# Altium project Heracles Nadir Panel.PrjPcb
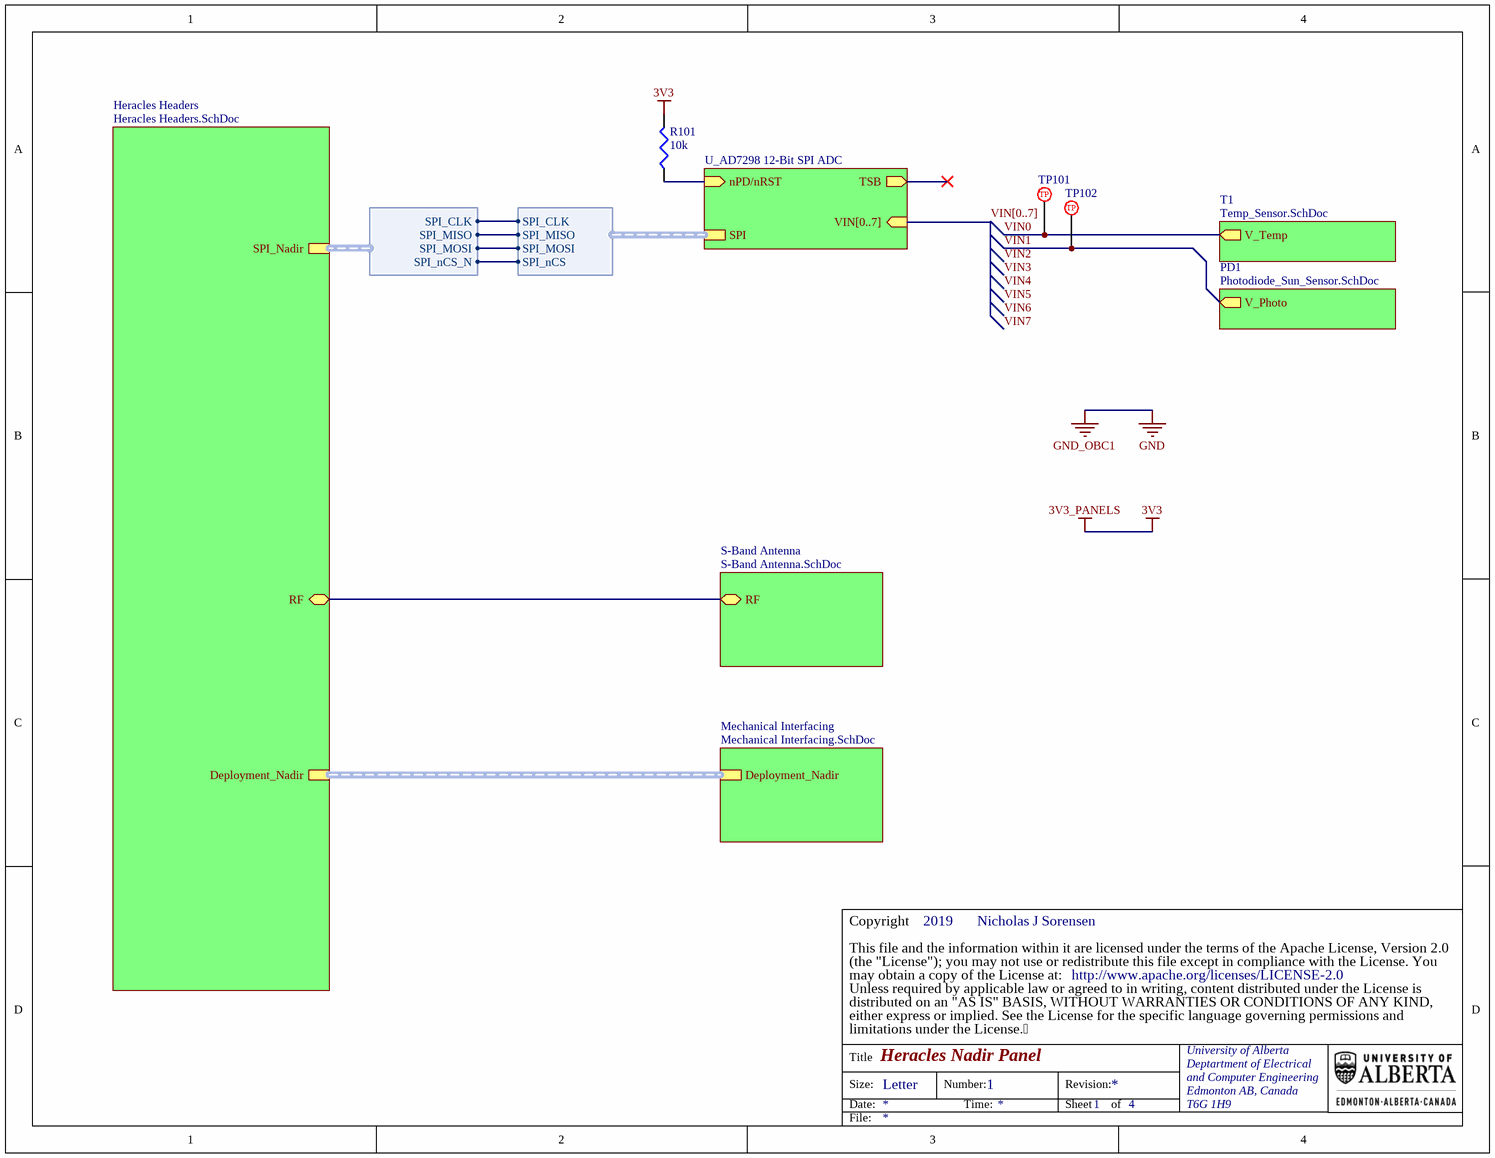
[diagram p0: Heracles Nadir Panel.SchDoc]
7 sheets, 30 parts. Net scope: hierarchical (ports join the sheet entries above them; power ports are global).
Board file: Heracles Nadir Panel.PcbDoc
Sheets:
  Heracles Nadir Panel.SchDoc
    Heracles Headers = Heracles Headers.SchDoc
    S-Band Antenna = S-Band Antenna.SchDoc
    Mechanical Interfacing = Mechanical Interfacing.SchDoc
    U_AD7298 12-Bit SPI ADC = AD7298 12-Bit SPI ADC.SchDoc
    T1 = Temp_Sensor.SchDoc
    PD1 = Photodiode_Sun_Sensor.SchDoc

## Sheet Heracles Nadir Panel.SchDoc: Heracles Nadir Panel
size Letter; Author: Nicholas J Sorensen; CompanyName: AlbertaSat; Engineer: Nicholas J Sorensen; DocumentNumber: 1; SheetNumber: 1; SheetTotal: 4; CopyrightYear: 2019

### Parts
R101  value 10k  [VSH-0603MCT]  (hidden comment: Res3)
TP101  5017  [KS-5017]  (value not drawn)
TP102  5017  [KS-5017]  (value not drawn)

### Sub-sheets
Heracles Headers = Heracles Headers.SchDoc: RF (bidir), SPI_Nadir (harness SPI_Nadir), Deployment_Nadir
Mechanical Interfacing = Mechanical Interfacing.SchDoc: Deployment_Nadir
PD1 = Photodiode_Sun_Sensor.SchDoc: V_Photo (out)
S-Band Antenna = S-Band Antenna.SchDoc: RF (bidir)
T1 = Temp_Sensor.SchDoc: V_Temp (out)
U_AD7298 12-Bit SPI ADC = AD7298 12-Bit SPI ADC.SchDoc: nPD/nRST (in), TSB (out), VIN[0..7] (in), SPI (harness AD7298_SPI)

### Harnesses
AD7298_SPI: SPI_CLK, SPI_MISO, SPI_MOSI, SPI_nCS
SPI_Nadir: SPI_CLK, SPI_MISO, SPI_MOSI, SPI_nCS_N

### Nets
3V3: R101.2  [also labelled 3V3_PANELS]
ADC_SPI_nCS_N: sheet U_AD7298 12-Bit SPI ADC/SPI.SPI_nCS, sheet Heracles Headers/SPI_Nadir.SPI_nCS_N
SPI_CLK: sheet U_AD7298 12-Bit SPI ADC/SPI.SPI_CLK, sheet Heracles Headers/SPI_Nadir.SPI_CLK
SPI_MISO: sheet U_AD7298 12-Bit SPI ADC/SPI.SPI_MISO, sheet Heracles Headers/SPI_Nadir.SPI_MISO
SPI_MOSI: sheet U_AD7298 12-Bit SPI ADC/SPI.SPI_MOSI, sheet Heracles Headers/SPI_Nadir.SPI_MOSI
VIN0: TP101.1 ; sheet T1/V_Temp
VIN1: TP102.1 ; sheet PD1/V_Photo  [project net V_Photo]
NetA301_1: sheet Heracles Headers/RF, sheet S-Band Antenna/RF
NetR101_1: R101.1 ; sheet U_AD7298 12-Bit SPI ADC/nPD/nRST

### Buses and harness runs
bus VIN[0..7] = sheet U_AD7298 12-Bit SPI ADC/VIN[0..7]
harness sheet Heracles Headers/Deployment_Nadir = sheet Mechanical Interfacing/Deployment_Nadir

### Notes on the sheet
- Labels drawn without touching a wire or pin: VIN2, VIN3, VIN4, VIN5, VIN6, VIN7
- (the "License"); you may not use or redistribute this file except in compliance with the License. You
- This file and the information within it are licensed under the terms of the Apache License, Version 2.0
- Copyright
- Unless required by applicable law or agreed to in writing, content distributed under the License is
- distributed on an "AS IS" BASIS, WITHOUT WARRANTIES OR CONDITIONS OF ANY KIND,
- either express or implied. See the License for the specific language governing permissions and
- limitations under the License.
- may obtain a copy of the License at:
- http://www.apache.org/licenses/LICENSE-2.0
- Title
- Size:
- Date:
- Letter
- Number:
- Time:
- Revision:
- Sheet
- of
- University of Alberta
- Deptartment of Electrical
- and Computer Engineering
- Edmonton AB, Canada
- T6G 1H9
- File:
- (in symbol PTP-KS-00001) TP

### Library data of the parts
R101 = PR-VSH-00143: RES SMD 10K OHM 1% 1/8W 0603; Manufacturer Part Number: MCT06030C1002FP500; Index: 143; Designator: R?; Temperature Coefficient: ±50ppm/°C; Published: 3/14/2016; LatestRevisionDate: 3/14/2016; LatestRevisionNote: ...; PackageReference: 0603 (1608 Metric); Publisher: AlbertaSat; PackageDescription: Chip Resistor, 2-Leads, Body 1.55x0.85mm, IPC Low Density; Part Number: PR-VSH-00143; Supplier Part Number 1: MCT0603-10.0K-CFCT-ND; Supplier 1: Digi-key; Supplier Link: http://www.digikey.ca/product-search/en?keywords=MCT0603-10.0K-CFCT-ND; Tolerance: ±1%; Power - Rated: 1/8W; Applications: General Purpose
TP101 TP102 = PTP-KS-00001: PC TEST POINT MINI SMD; Index: 1; Supplier 1: Digi-key; Supplier 2: Newark; Supplier 3: Mouser; Part Number: PTP-KS-00001; Manufacturer Part Number: 5017; Supplier Part Number 1: 36-5017CT-ND; Publisher: AlbertaSat; Published: 3/15/2016; LatestRevisionDate: 3/15/2016; LatestRevisionNote: ...; PackageReference: KS-5017; PackageDescription: Testpoint Lug Mini SMD 27X10X152; Supplier Link: http://www.digikey.ca/product-detail/en/keystone-electronics/5017/36-5017TR-ND/2217304

## Sheet Heracles Headers.SchDoc: Heracles Headers
size Letter; Author: Nicholas J. Sorensen; Engineer: Nicholas J. Sorensen; DocumentNumber: 2; SheetNumber: 2; SheetTotal: 4
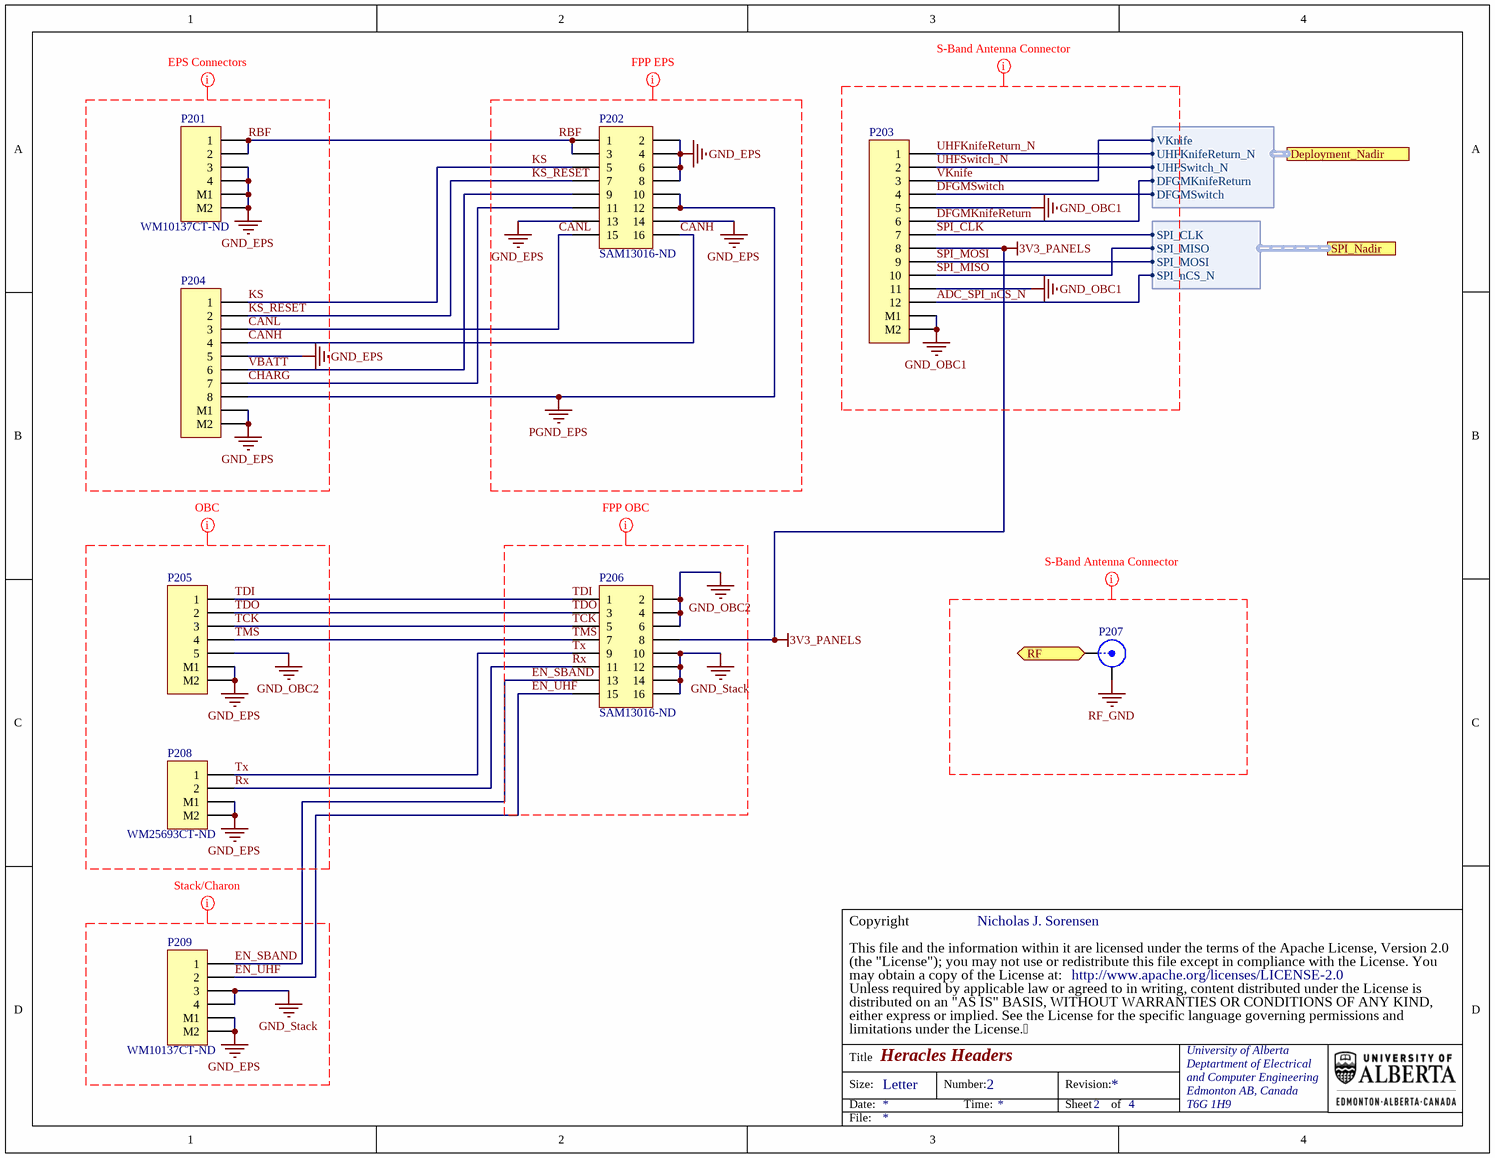
[diagram p1: Heracles Headers.SchDoc]

### Parts
P201  WM10137CT-ND  [MOLX-5040500491]
P202  SAM13016-ND  [TSS-108-01-G-D]
P203  PICOLOCK 12  [MOLX-5040501291]  (value not drawn)
P204  WM14421CT-ND  [MOLX-5040500891]  (value not drawn)
P205  PICOLOCK 5  [MOLX-5040500591]  (value not drawn)
P206  SAM13016-ND  [TSS-108-01-G-D]
P207  J10399-ND  [J10399-ND]  (value not drawn)
P208  WM25693CT-ND  [MOLX-5040500291]
P209  WM10137CT-ND  [MOLX-5040500491]

### Ports
Deployment_Nadir (harness Deployment_Nadir), RF (bidir), SPI_Nadir (harness SPI_Nadir)

### Harnesses
Deployment_Nadir: UHFSwitch_N, UHFKnifeReturn_N, VKnife, DFGMKnifeReturn, DFGMSwitch
SPI_Nadir: SPI_CLK, SPI_MISO, SPI_MOSI, SPI_nCS_N

### Nets
3V3_PANELS: P203.8 P206.8  [project net 3V3]
GND_EPS: P201.3 P201.4 P201.M1 P201.M2 P202.2 P202.4 P202.6 P202.8 P202.13 P202.14 P204.5 P204.M1 P204.M2 P205.M1 P205.M2 P208.M1 P208.M2 P209.M1 P209.M2
GND_OBC1: P203.5 P203.11 P203.M1 P203.M2  [project net GND]
GND_OBC2: P205.5 P206.2 P206.4 P206.6
GND_Stack: P206.10 P206.12 P206.14 P206.16 P209.3 P209.4
PGND_EPS: P202.10 P202.12 P204.8
RF_GND: P207.2(Y)
ADC_SPI_nCS_N: P203.12 ; port SPI_Nadir.SPI_nCS_N
CANH: P202.16 P204.4
CANL: P202.15 P204.3
CHARG: P202.11 P204.7
DFGMKnifeReturn: P203.6 ; port Deployment_Nadir.DFGMKnifeReturn
DFGMSwitch: P203.4 ; port Deployment_Nadir.DFGMSwitch
EN_SBAND: P206.13 P209.1
EN_UHF: P206.15 P209.2
KS: P202.5 P204.1
KS_RESET: P202.7 P204.2
RBF: P201.1 P201.2 P202.1 P202.3
Rx: P206.11 P208.2
SPI_CLK: P203.7 ; port SPI_Nadir.SPI_CLK
SPI_MISO: P203.10 ; port SPI_Nadir.SPI_MISO
SPI_MOSI: P203.9 ; port SPI_Nadir.SPI_MOSI
TCK: P205.3 P206.5
TDI: P205.1 P206.1
TDO: P205.2 P206.3
TMS: P205.4 P206.7
Tx: P206.9 P208.1
UHFKnifeReturn_N: P203.1 ; port Deployment_Nadir.UHFKnifeReturn_N
UHFSwitch_N: P203.2 ; port Deployment_Nadir.UHFSwitch_N
VBATT: P202.9 P204.6
VKnife: P203.3 ; port Deployment_Nadir.VKnife
NetA301_1: P207.1(X) ; port RF

### Layout directives
mark named EPS Connectors: CANH, CANL, CHARG, GND_EPS, KS, KS_RESET, RBF, VBATT
mark named OBC: GND_EPS, GND_OBC2, Rx, TCK, TDI, TDO, TMS, Tx
mark named FPP EPS: CANH, CANL, GND_EPS, KS, KS_RESET, PGND_EPS, RBF
mark named FPP OBC: EN_SBAND, EN_UHF, GND_OBC2, GND_Stack, Rx, TCK, TDI, TDO, TMS, Tx
mark named Stack/Charon: EN_SBAND, EN_UHF, GND_EPS, GND_Stack
mark named S-Band Antenna Connector: 3V3_PANELS, ADC_SPI_nCS_N, DFGMKnifeReturn, DFGMSwitch, GND_OBC1, RF_GND, SPI_CLK, SPI_MISO, SPI_MOSI, UHFKnifeReturn_N, UHFSwitch_N, VKnife

### Notes on the sheet
- (the "License"); you may not use or redistribute this file except in compliance with the License. You
- This file and the information within it are licensed under the terms of the Apache License, Version 2.0
- Copyright
- Unless required by applicable law or agreed to in writing, content distributed under the License is
- distributed on an "AS IS" BASIS, WITHOUT WARRANTIES OR CONDITIONS OF ANY KIND,
- either express or implied. See the License for the specific language governing permissions and
- limitations under the License.
- may obtain a copy of the License at:
- http://www.apache.org/licenses/LICENSE-2.0
- Title
- Size:
- Date:
- Letter
- Number:
- Time:
- Revision:
- Sheet
- of
- University of Alberta
- Deptartment of Electrical
- and Computer Engineering
- Edmonton AB, Canada
- T6G 1H9
- File:

### Library data of the parts
P201 P209 = 63: CONN HEADER SMD R/A 4POS 1.5MM; Part Number: 63; Manufacturer Part Number: 5040500491; Designator: P?; LatestRevisionDate: 17-Jul-2002; LatestRevisionNote: Re-released for DXP Platform.; Publisher: Altium Limited; Supplier Part Number 1: WM10137CT-ND; Supplier 1: Digi-Key; Supplier Link: #https://www.digikey.ca/product-detail/en/molex/5040500491/WM10137CT-ND/4357653#
P202 P206 = PP-SAM-00007: CONN HEADER VERT 16POS 2.54MM; Index: 8; LatestRevisionDate: 7/1/2020; LatestRevisionNote: ...; Publisher: AlbertaSat; Part Number: PP-SAM-00007; Manufacturer Part Number: TSS-108-01-G-D; Supplier Part Number 1: SAM13016-ND; Supplier 1: Digi-key; Published: 7/1/2020; Supplier Link: #https://www.digikey.ca/en/products/detail/samtec-inc/TSS-108-01-G-D/2345166#
P203 = 71: CONN HEADER SMD R/A 12POS 1.5MM; Part Number: 71; Manufacturer Part Number: 5040501291; Designator: P?; LatestRevisionDate: 17-Jul-2002; LatestRevisionNote: Re-released for DXP Platform.; Publisher: Altium Limited; Supplier Part Number 1: WM16219CT-ND; Supplier 1: Digi-Key; Supplier Link: #https://www.digikey.ca/product-detail/en/molex/5040501291/WM16219CT-ND/6702294#
P204 = 67: CONN HEADER SMD R/A 8POS 1.5MM; Part Number: 67; Manufacturer Part Number: 5040500891; Designator: P?; LatestRevisionDate: 17-Jul-2002; LatestRevisionNote: Re-released for DXP Platform.; Publisher: Altium Limited; Supplier Part Number 1: WM14421CT-ND; Supplier 1: Digi-Key; Supplier Link: #https://www.digikey.ca/product-detail/en/molex/5040500891/WM14421CT-ND/6133151#
P205 = 64: CONN HEADER SMD R/A 5POS 1.5MM; Part Number: 64; Manufacturer Part Number: 5040500591; Designator: P?; LatestRevisionDate: 17-Jul-2002; LatestRevisionNote: Re-released for DXP Platform.; Publisher: Altium Limited; Supplier Part Number 1: WM24877CT-ND; Supplier 1: Digi-Key; Supplier Link: https://www.digikey.ca/product-detail/en/molex/5040500591/WM24877CT-ND/9659635
P207 = P01-CIN-00000: CONN SMB PLUG R/A 50OHM PCB; Manufacturer Part Number: Cinch Connectivity Solutions Johnson; Index: 1; Designator: P?; LatestRevisionDate: 7/6/2020; LatestRevisionNote: ...; Publisher: AlbertaSat; Part Number: P01-CIN-00000; Supplier Part Number 1: J10399-ND; Supplier 1: Digi-key; Published: 7/6/2020; Supplier Link: #https://www.digikey.ca/en/products/detail/cinch-connectivity-solutions-johnson/131-1801-371/251419#
P208 = 61: CONN HEADER SMD R/A 2POS 1.5MM; Part Number: 61; Manufacturer Part Number: 5040500291; Designator: P?; LatestRevisionDate: 17-Jul-2002; LatestRevisionNote: Re-released for DXP Platform.; Publisher: Altium Limited; Supplier Part Number 1: WM25693CT-ND; Supplier 1: Digi-Key; Supplier Link: #https://www.digikey.ca/product-detail/en/molex/5040500291/WM25693CT-ND/9954119#

## Sheet S-Band Antenna.SchDoc: S-Band Antenna
size Letter; Author: Nicholas J. Sorensen; Engineer: Nicholas J. Sorensen; DocumentNumber: 3; SheetNumber: 3; SheetTotal: 4
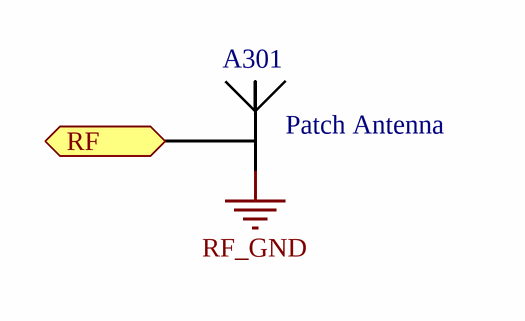
[diagram p2: S-Band Antenna.SchDoc]

### Parts
A301  Patch Antenna  [Patch_Antenna]

### Ports
RF (bidir)

### Nets
RF_GND: A301.2
NetA301_1: A301.1 ; port RF

### Notes on the sheet
- (the "License"); you may not use or redistribute this file except in compliance with the License. You
- This file and the information within it are licensed under the terms of the Apache License, Version 2.0
- Copyright
- Unless required by applicable law or agreed to in writing, content distributed under the License is
- distributed on an "AS IS" BASIS, WITHOUT WARRANTIES OR CONDITIONS OF ANY KIND,
- either express or implied. See the License for the specific language governing permissions and
- limitations under the License.
- may obtain a copy of the License at:
- http://www.apache.org/licenses/LICENSE-2.0
- Title
- Size:
- Date:
- Letter
- Number:
- Time:
- Revision:
- Sheet
- of
- University of Alberta
- Deptartment of Electrical
- and Computer Engineering
- Edmonton AB, Canada
- T6G 1H9
- File:

### Library data of the parts
A301 = PXX-ABS-00009: Manufacturer Part Number: Custom; Index: 9; Part Number: PXX-ABS-00009; Supplier 1: Digi-key; Publisher: AlbertaSat; LatestRevisionNote: ...

## Sheet Mechanical Interfacing.SchDoc: Mechanical Interfacing
size Letter; Author: Nicholas J. Sorensen; Engineer: Nicholas J. Sorensen; DocumentNumber: 4; SheetNumber: 4; SheetTotal: 4
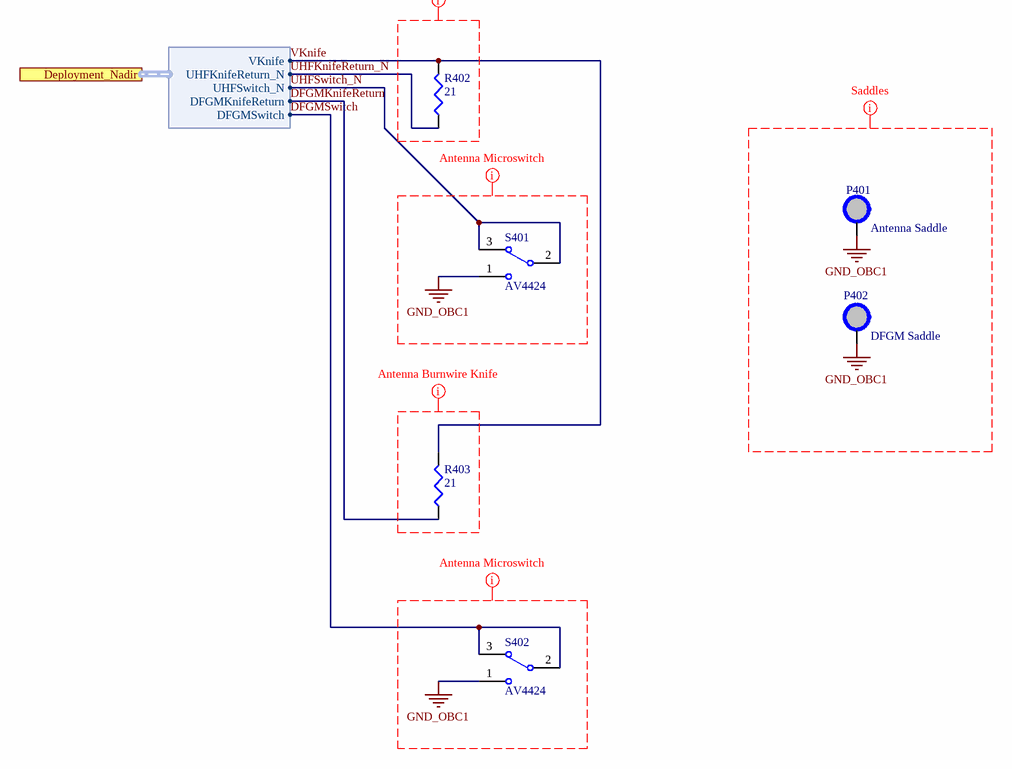
[diagram p3: Mechanical Interfacing.SchDoc]

### Parts
P401  Antenna Saddle  [ANTENNA_SADDLE]
P402  DFGM Saddle  [DFGM_Saddle]
R402  value 21  [VSH-CPF1]  (hidden comment: Res3)
R403  value 21  [VSH-CPF1]  (hidden comment: Res3)
S401  AV4424  [PANA-AV4424]
S402  AV4424  [PANA-AV4424]

### Ports
Deployment_Nadir (harness Deployment_Nadir)

### Harnesses
Deployment_Nadir: UHFSwitch_N, UHFKnifeReturn_N, VKnife, DFGMKnifeReturn, DFGMSwitch

### Nets
GND_OBC1: P401.1 P402.1 S401.1(NO) S402.1(NO)  [project net GND]
DFGMKnifeReturn: R403.1 ; port Deployment_Nadir.DFGMKnifeReturn
DFGMSwitch: S402.2(COM) S402.3(NC) ; port Deployment_Nadir.DFGMSwitch
UHFKnifeReturn_N: R402.1 ; port Deployment_Nadir.UHFKnifeReturn_N
UHFSwitch_N: S401.2(COM) S401.3(NC) ; port Deployment_Nadir.UHFSwitch_N
VKnife: R402.2 R403.2 ; port Deployment_Nadir.VKnife

### Layout directives
mark named Antenna Burnwire Knife: (no net found under the mark)
mark named Antenna Microswitch: GND_OBC1
mark named Saddles: GND_OBC1

### Notes on the sheet
- (the "License"); you may not use or redistribute this file except in compliance with the License. You
- This file and the information within it are licensed under the terms of the Apache License, Version 2.0
- Copyright
- Unless required by applicable law or agreed to in writing, content distributed under the License is
- distributed on an "AS IS" BASIS, WITHOUT WARRANTIES OR CONDITIONS OF ANY KIND,
- either express or implied. See the License for the specific language governing permissions and
- limitations under the License.
- may obtain a copy of the License at:
- http://www.apache.org/licenses/LICENSE-2.0
- Title
- Size:
- Date:
- Letter
- Number:
- Time:
- Revision:
- Sheet
- of
- University of Alberta
- Deptartment of Electrical
- and Computer Engineering
- Edmonton AB, Canada
- T6G 1H9
- File:

### Library data of the parts
P401 = PXX-ABS-00001: Manufacturer Part Number: Custom; Index: 1; Designator: M?; Part Number: PXX-ABS-00001; Supplier 1: Digi-key; Publisher: AlbertaSat; LatestRevisionNote: ...
P402 = PXX-ABS-00010: Manufacturer Part Number: Custom; Index: 10; Designator: P?; Part Number: PXX-ABS-00010; Supplier 1: Digi-key; Publisher: AlbertaSat; LatestRevisionNote: ...
R402 R403 = PR-VSH-00317: 21 Ohms ±1% 1W Through Hole Resistor Axial Flame Proof, Moisture Resistant, Safety Metal Film; Manufacturer Part Number: CPF121R000FKEE6; Index: 317; Designator: R?; Temperature Coefficient: ±100ppm/°C; Published: 2/27/2020; LatestRevisionDate: 2/27/2020; LatestRevisionNote: ...; PackageReference: VSH-CPF1; Publisher: AlbertaSat; PackageDescription: Chip Resistor; Part Number: PR-VSH-00317; Supplier Part Number 1: CPF21.0CCT-ND; Supplier 1: Digi-key; Supplier Link: #https://www.digikey.ca/product-detail/en/vishay-dale/CPF121R000FKEE6/CPF21.0CCT-ND/2713126#; Tolerance: ±1%; Power - Rated: 1W
S401 S402 = 20035: SWITCH SNAP ACT SPDT 500MA 30V; Part Number: 20035; Manufacturer Part Number: AV4424; Supplier Part Number 1: 255-3743-ND; Supplier 1: Digi-Key; Supplier Link: #https://www.digikey.com/product-detail/en/panasonic-electric-works/AV4424/255-3743-ND/646766#

## Sheet AD7298 12-Bit SPI ADC.SchDoc: AD7298 12-Bit SPI ADC
size Letter; Author: Nicholas J. Sorensen, and Erik F. Halliwell; Engineer: Nicholas J. Sorensen, and Erik F. Halliwell*; DocumentNumber: 2; SheetNumber: 2; SheetTotal: 7; CopyrightYear: 2019
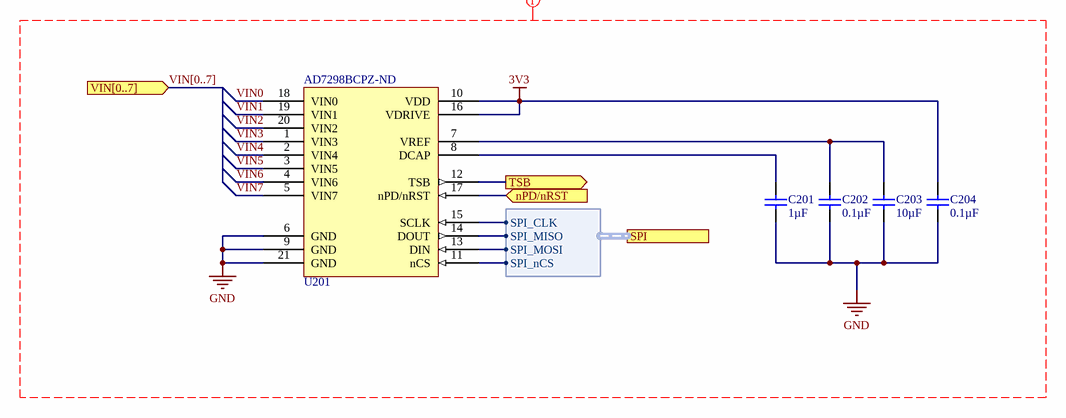
[diagram p4: AD7298 12-Bit SPI ADC.SchDoc]

### Parts
C201  value 1µF  [TDK-CGA3E]
C202  value 0.1µF  [TDK-CGA2B]
C203  value 10µF  [TDK-CGA5L]
C204  value 0.1µF  [TDK-CGA2B]
U201  AD7298BCPZ-ND  [ADI-CP-20-8]

### Ports
nPD/nRST (in), SPI (harness AD7298_SPI), TSB (out), VIN[0..7] (in)

### Harnesses
AD7298_SPI: SPI_MOSI, SPI_MISO, SPI_CLK, SPI_nCS

### Nets
3V3: C204.1 U201.10(VDD) U201.16(VDRIVE)
GND: C201.1 C202.2 C203.2 C204.2 U201.6(GND) U201.9(GND) U201.21(GND)
ADC_SPI_nCS_N: U201.11(nCS) ; port SPI.SPI_nCS
SPI_CLK: U201.15(SCLK) ; port SPI.SPI_CLK
SPI_MISO: U201.14(DOUT) ; port SPI.SPI_MISO
SPI_MOSI: U201.13(DIN) ; port SPI.SPI_MOSI
VIN0: U201.18(VIN0)
VIN1: U201.19(VIN1)  [project net V_Photo]
VIN2: U201.20(VIN2)
VIN3: U201.1(VIN3)
VIN4: U201.2(VIN4)
VIN5: U201.3(VIN5)
VIN6: U201.4(VIN6)
VIN7: U201.5(VIN7)
NetC201_2: C201.2 U201.8(DCAP)
NetC202_1: C202.1 C203.1 U201.7(VREF)
NetR101_1: U201.17(nPD/nRST) ; port nPD/nRST
NetU201_12: U201.12(TSB) ; port TSB

### Buses and harness runs
bus VIN[0..7] = port VIN[0..7]

### Layout directives
mark named ADC: 3V3, GND, VIN0, VIN1, VIN2, VIN3, VIN4, VIN5, VIN6, VIN7, VIN[0..7]

### Notes on the sheet
- (the "License"); you may not use or redistribute this file except in compliance with the License. You
- This file and the information within it are licensed under the terms of the Apache License, Version 2.0
- Copyright
- Unless required by applicable law or agreed to in writing, content distributed under the License is
- distributed on an "AS IS" BASIS, WITHOUT WARRANTIES OR CONDITIONS OF ANY KIND,
- either express or implied. See the License for the specific language governing permissions and
- limitations under the License.
- may obtain a copy of the License at:
- http://www.apache.org/licenses/LICENSE-2.0
- Title
- Size:
- Date:
- Letter
- Number:
- Time:
- Revision:
- Sheet
- of
- University of Alberta
- Deptartment of Electrical
- and Computer Engineering
- Edmonton AB, Canada
- T6G 1H9
- File:

### Library data of the parts
C201 = PC-TDK-02603: CAP CER 1UF 25V X7R 0603; Manufacturer Part Number: CGA3E1X7R1E105K080AC; Index: 2603; Tolerance: ±10%; Designator: C?; Published: 3/16/2016; LatestRevisionDate: 3/16/2016; LatestRevisionNote: ...; PackageReference: 0603 (1608 Metric); Publisher: AlbertaSat; Part Number: PC-TDK-02603; Supplier Part Number 1: 445-6931-1-ND; Supplier 1: Digi-key; Supplier Link: http://www.digikey.ca/product-search/en?keywords=445-6931-1-ND; Voltage - Rated: 25V; Temperature Coefficient: X7R; Applications: Automotive
C202 C204 = PC-TDK-02259: CAP CER 0.1UF 50V X7R 0402; Manufacturer Part Number: CGA2B3X7R1H104K050BB; Index: 2259; Tolerance: ±10%; Designator: C?; Published: 3/16/2016; LatestRevisionDate: 3/16/2016; LatestRevisionNote: ...; PackageReference: 0402 (1005 Metric); Publisher: AlbertaSat; Part Number: PC-TDK-02259; Supplier Part Number 1: 445-6899-1-ND; Supplier 1: Digi-key; Supplier Link: http://www.digikey.ca/product-search/en?keywords=445-6899-1-ND; Voltage - Rated: 50V; Temperature Coefficient: X7R; Applications: Automotive
C203 = PC-TDK-02917: CAP CER 10UF 25V X7R 1206; Manufacturer Part Number: CGA5L1X7R1E106K160AC; Index: 2917; Tolerance: ±10%; Designator: C?; Published: 3/16/2016; LatestRevisionDate: 3/16/2016; LatestRevisionNote: ...; PackageReference: 1206 (3216 Metric); Publisher: AlbertaSat; Part Number: PC-TDK-02917; Supplier Part Number 1: 445-6990-1-ND; Supplier 1: Digi-key; Supplier Link: http://www.digikey.ca/product-search/en?keywords=445-6990-1-ND; Voltage - Rated: 25V; Temperature Coefficient: X7R; Applications: Automotive
U201 = PU-ADI-00007: IC ADC 12BIT SAR 20LFCSP-WQ; Index: 7; Designator: U?; Part Number: PU-ADI-00007; Manufacturer Part Number: AD7298BCPZ; Supplier Part Number 1: AD7298BCPZ-ND; Supplier 1: Digi-key; Supplier Part Number 2: 584-AD7298BCPZ; Supplier 2: Mouser; Publisher: AlbertaSat; Published: 7/16/2019; LatestRevisionDate: 7/16/2019; LatestRevisionNote: ...; PackageReference: 20-WFQFN Exposed Pad; PackageDescription: QFN, 20-Leads, Body 4.00x4.00mm, Pitch 0.50mm, Thermal Pad 2.55x2.55mm, IPC Low Density; Supplier Link: #https://www.digikey.ca/product-detail/en/analog-devices-inc/AD7298BCPZ/AD7298BCPZ-ND/2507320#

## Sheet Temp_Sensor.SchDoc: Temp_Sensor
size Letter; Author: Nicholas J. Sorensen, and Erik F. Halliwell; Engineer: Nicholas J. Sorensen, and Erik F. Halliwell; DocumentNumber: 5; SheetNumber: 5; SheetTotal: 7
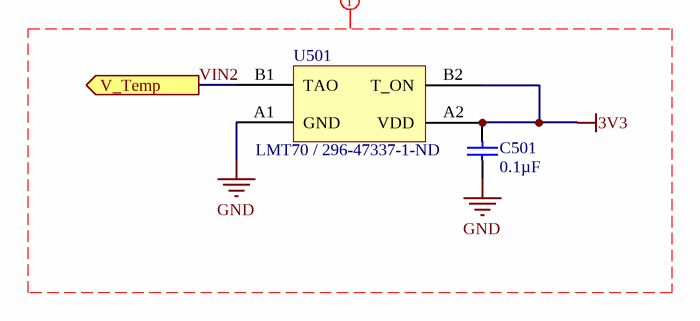
[diagram p5: Temp_Sensor.SchDoc]

### Parts
C501  value 0.1µF  [TDK-CGA2B]  (hidden comment: Cap)
U501  LMT70 / 296-47337-1-ND  [TI-YFQ0004]

### Ports
V_Temp (out)

### Nets
3V3: C501.2 U501.A2(VDD) U501.B2(T_ON)
GND: C501.1 U501.A1(GND)
VIN2: U501.B1(TAO) ; port V_Temp  [project net VIN0]

### Layout directives
mark named Temperature Sensors: 3V3, GND, VIN2

### Notes on the sheet
- (the "License"); you may not use or redistribute this file except in compliance with the License. You
- This file and the information within it are licensed under the terms of the Apache License, Version 2.0
- Copyright
- Unless required by applicable law or agreed to in writing, content distributed under the License is
- distributed on an "AS IS" BASIS, WITHOUT WARRANTIES OR CONDITIONS OF ANY KIND,
- either express or implied. See the License for the specific language governing permissions and
- limitations under the License.
- may obtain a copy of the License at:
- http://www.apache.org/licenses/LICENSE-2.0
- Title
- Size:
- Date:
- Letter
- Number:
- Time:
- Revision:
- Sheet
- of
- University of Alberta
- Deptartment of Electrical
- and Computer Engineering
- Edmonton AB, Canada
- T6G 1H9
- File:

### Library data of the parts
C501 = PC-TDK-02259: CAP CER 0.1UF 50V X7R 0402; Manufacturer Part Number: CGA2B3X7R1H104K050BB; Index: 2259; Tolerance: ±10%; Published: 2016-03-16; LatestRevisionDate: 2016-03-16; LatestRevisionNote: ...; PackageReference: 0402 (1005 Metric); Publisher: AlbertaSat; PackageDescription: Radial Cap, Thru-Hole; 2 Leads; 0.3 in Pin Spacing; Part Number: PC-TDK-02259; Supplier Part Number 1: 445-6899-1-ND; Supplier 1: Digi-key; Supplier Link: http://www.digikey.ca/product-search/en?keywords=445-6899-1-ND; Voltage - Rated: 50V; Temperature Coefficient: X7R; Applications: Automotive
U501 = 70: Temperature Sensor Analog, Local -55°C ~ 150°C 5.194mV/°C 4-DSBGA (0.81x0.81); Part Number: 70; Manufacturer Part Number: LMT70YFQR; Supplier Part Number 1: 296-47337-1-ND; Supplier 1: Digi-Key; Supplier Link: #https://www.digikey.ca/product-detail/en/texas-instruments/LMT70YFQR/296-47337-1-ND/7688347#; PackageReference: BGA, 4-Leads, Body 0.88x0.88mmx0.68mm, Pitch 0.40mm; Operating Temperature: -55°C ~ 150°C

## Sheet Photodiode_Sun_Sensor.SchDoc: Photodiode_Sun_Sensor
size Letter; Author: Nicholas J. Sorensen, and Erik F. Halliwell; Engineer: Nicholas J. Sorensen, and Erik F. Halliwell; DocumentNumber: 4; SheetNumber: 4; SheetTotal: 7
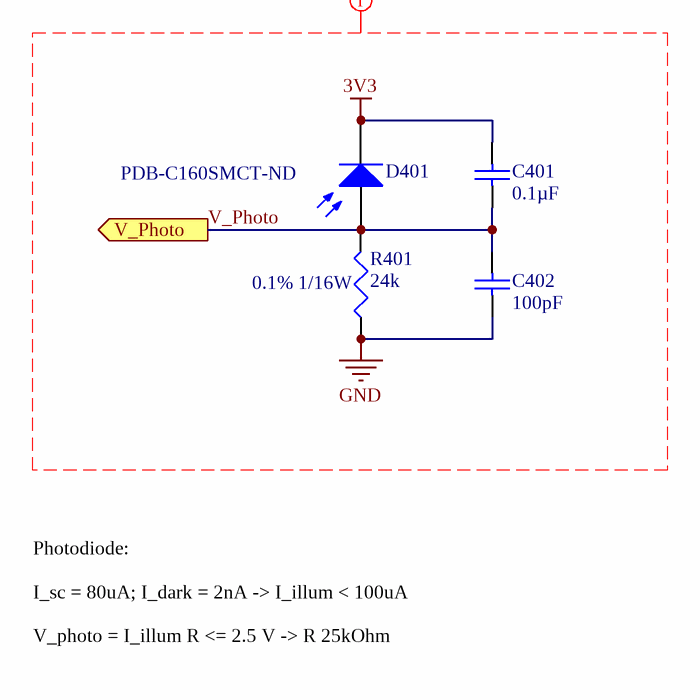
[diagram p6: Photodiode_Sun_Sensor.SchDoc]

### Parts
C401  value 0.1µF  [TDK-CGA2B]  (hidden comment: Cap)
C402  value 100pF  [TDK-CGA2B]  (hidden comment: Cap)
D401  PDB-C160SMCT-ND  [PDB-C160SM]
R401  0.1% 1/16W  value 24k  [PANA-ERA2A]

### Ports
V_Photo (out)

### Nets
3V3: C401.2 D401.2(K)
GND: C402.1 R401.1
V_Photo: C401.1 C402.2 D401.1(A) R401.2 ; port V_Photo

### Layout directives
mark named Photodiode Sun Sensors: 3V3, GND, V_Photo

### Notes on the sheet
- Photodiode:
  I_sc = 80uA; I_dark = 2nA -> I_illum < 100uA
  V_photo = I_illum R <= 2.5 V -> R 25kOhm
- (the "License"); you may not use or redistribute this file except in compliance with the License. You
- This file and the information within it are licensed under the terms of the Apache License, Version 2.0
- Copyright
- Unless required by applicable law or agreed to in writing, content distributed under the License is
- distributed on an "AS IS" BASIS, WITHOUT WARRANTIES OR CONDITIONS OF ANY KIND,
- either express or implied. See the License for the specific language governing permissions and
- limitations under the License.
- may obtain a copy of the License at:
- http://www.apache.org/licenses/LICENSE-2.0
- Title
- Size:
- Date:
- Letter
- Number:
- Time:
- Revision:
- Sheet
- of
- University of Alberta
- Deptartment of Electrical
- and Computer Engineering
- Edmonton AB, Canada
- T6G 1H9
- File:

### Library data of the parts
C401 = PC-TDK-02259: as C501 on sheet Temp_Sensor; Published: 2016-03-16; LatestRevisionDate: 2016-03-16; LatestRevisionNote: ...; PackageReference: 0402 (1005 Metric); Publisher: AlbertaSat; PackageDescription: Radial Cap, Thru-Hole; 2 Leads; 0.3 in Pin Spacing; Part Number: PC-TDK-02259; Supplier Part Number 1: 445-6899-1-ND; Supplier 1: Digi-key; Supplier Link: http://www.digikey.ca/product-search/en?keywords=445-6899-1-ND; Voltage - Rated: 50V; Temperature Coefficient: X7R; Applications: Automotive
C402 = PC-TDK-01227: CAP CER 100PF 50V C0G 0402; Manufacturer Part Number: CGA2B2C0G1H101J050BA; Index: 1227; Tolerance: ±5%; Temperature Coefficient: NP0; Published: 2016-03-16; LatestRevisionDate: 2016-03-16; LatestRevisionNote: ...; PackageReference: 0402 (1005 Metric); Publisher: AlbertaSat; PackageDescription: Radial Cap, Thru-Hole; 2 Leads; 0.3 in Pin Spacing; Part Number: PC-TDK-01227; Supplier Part Number 1: 445-5596-1-ND; Supplier 1: Digi-key; Supplier Link: http://www.digikey.ca/product-search/en?keywords=445-5596-1-ND; Voltage - Rated: 50V; Applications: Automotive
D401 = PXX-ADP-00000: SENSOR PHOTODIODE 850NM 2SMD GW; Manufacturer Part Number: Advanced Photonics; Index: 1; Designator: D?; Published: 3/28/2020; LatestRevisionDate: 3/28/2020; LatestRevisionNote: ...; PackageReference: PIN2; Publisher: AlbertaSat; Part Number: PXX-ADP-00000; Supplier Part Number 1: PDB-C160SMCT-ND; Supplier 1: Digi-key
R401 = 17830: RES SMD 24K OHM 0.1% 1/16W 0402; Part Number: 17830; Manufacturer Part Number: ERA-2APB243X; Designator: R?; Power: 0.063W, 1/16W; Temperature Coefficient: ±15ppm/°C; Published: 8-Jun-2000; LatestRevisionDate: 29-May-2009; LatestRevisionNote: IPC-7351 Footprint Added.; PackageReference: 0402 (1005 Metric); Publisher: Altium Limited; PackageDescription: Chip Resistor, 2-Leads, Body 1.00x0.50mm, IPC Low Density; Supplier Part Number 1: P24KCNCT-ND; Supplier 1: Digi-Key; Supplier Link: http://www.digikey.ca/product-search/en?keywords=P24KCNCT-ND; Tolerance: ±0.1%

## Nets that join several sheets
3V3: Heracles Nadir Panel (R101.2), Heracles Headers (P203.8 P206.8), AD7298 12-Bit SPI ADC (C204.1 U201.10 U201.16), Temp_Sensor (C501.2 U501.A2 U501.B2), Photodiode_Sun_Sensor (C401.2 D401.2)
GND: Heracles Headers (P203.5 P203.11 P203.M1 P203.M2), Mechanical Interfacing (P401.1 P402.1 S401.1 S402.1), AD7298 12-Bit SPI ADC (7 pins), Temp_Sensor (C501.1 U501.A1), Photodiode_Sun_Sensor (C402.1 R401.1)
RF_GND: Heracles Headers (P207.2), S-Band Antenna (A301.2)
ADC_SPI_nCS_N: Heracles Headers (P203.12), AD7298 12-Bit SPI ADC (U201.11)
DFGMKnifeReturn: Heracles Headers (P203.6), Mechanical Interfacing (R403.1)
DFGMSwitch: Heracles Headers (P203.4), Mechanical Interfacing (S402.2 S402.3)
NetA301_1: Heracles Headers (P207.1), S-Band Antenna (A301.1)
NetR101_1: Heracles Nadir Panel (R101.1), AD7298 12-Bit SPI ADC (U201.17)
SPI_CLK: Heracles Headers (P203.7), AD7298 12-Bit SPI ADC (U201.15)
SPI_MISO: Heracles Headers (P203.10), AD7298 12-Bit SPI ADC (U201.14)
SPI_MOSI: Heracles Headers (P203.9), AD7298 12-Bit SPI ADC (U201.13)
UHFKnifeReturn_N: Heracles Headers (P203.1), Mechanical Interfacing (R402.1)
UHFSwitch_N: Heracles Headers (P203.2), Mechanical Interfacing (S401.2 S401.3)
V_Photo: Heracles Nadir Panel (TP102.1), AD7298 12-Bit SPI ADC (U201.19), Photodiode_Sun_Sensor (C401.1 C402.2 D401.1 R401.2)
VIN0: Heracles Nadir Panel (TP101.1), AD7298 12-Bit SPI ADC (U201.18), Temp_Sensor (U501.B1)
VKnife: Heracles Headers (P203.3), Mechanical Interfacing (R402.2 R403.2)